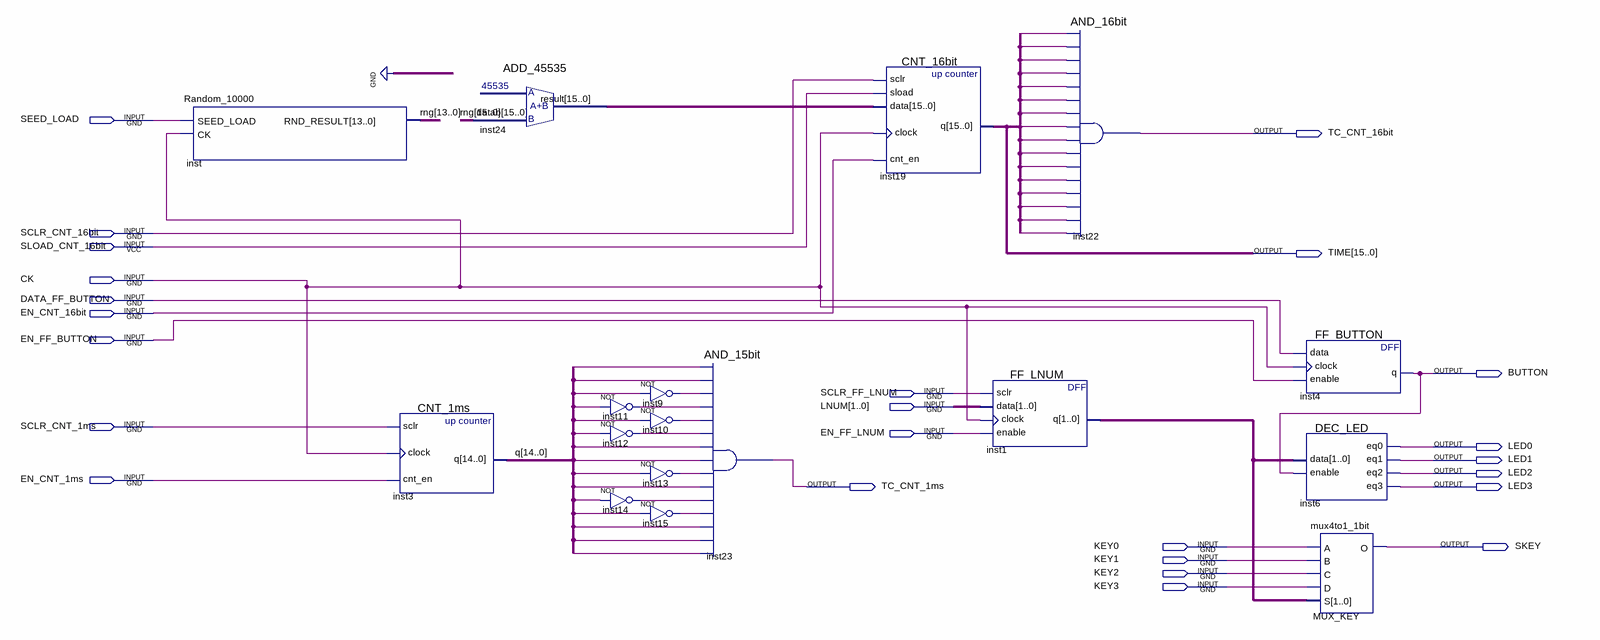
[diagram p0: schematic sheet]
// Quartus schematic reflexes_DP.bdf as structural Verilog: 17 symbols, 25 pins
module reflexes_DP (
  input  SEED_LOAD,
  input  SCLR_CNT_16bit,
  input  SLOAD_CNT_16bit,
  input  CK,
  input  DATA_FF_BUTTON,
  input  EN_CNT_16bit,
  input  EN_FF_BUTTON,
  input  SCLR_FF_LNUM,
  input  [1:0] LNUM,
  input  SCLR_CNT_1ms,
  input  EN_FF_LNUM,
  input  EN_CNT_1ms,
  input  KEY0,
  input  KEY1,
  input  KEY2,
  input  KEY3,
  output TC_CNT_16bit,
  output [15:0] TIME,
  output BUTTON,
  output LED0,
  output LED1,
  output LED2,
  output TC_CNT_1ms,
  output LED3,
  output SKEY
);

  wire inst9_out, inst10_out, inst11_out, inst12_out, inst13_out, inst14_out, inst15_out;
  wire [1:0] inst1_q;
  wire [13:0] rng;
  wire [14:0] q;
  wire [15:0] inst24_result;

  Random_10000 inst (.SEED_LOAD(SEED_LOAD), .CK(CK), .RND_RESULT(rng));
  CNT_1ms inst3 (.sclr(SCLR_CNT_1ms), .clock(CK), .cnt_en(EN_CNT_1ms), .q(q));
  ADD_45535 inst24 (.datab({2'b00, rng}), .result(inst24_result));
  not inst11 (inst11_out, q[11]);
  not inst12 (inst12_out, q[9]);
  not inst14 (inst14_out, q[4]);
  not inst9 (inst9_out, q[12]);
  not inst10 (inst10_out, q[10]);
  not inst13 (inst13_out, q[6]);
  not inst15 (inst15_out, q[3]);
  AND_15bit inst23 (
    .data0(q[14]), .data1(q[13]), .data2(inst9_out), .data3(inst11_out), .data4(inst10_out),
    .data5(inst12_out), .data6(q[8]), .data7(q[7]), .data8(inst13_out), .data9(q[5]), .data10(inst14_out),
    .data11(inst15_out), .data12(q[2]), .data13(q[1]), .data14(q[0]), .result(TC_CNT_1ms));
  CNT_16bit inst19 (
    .sclr(SCLR_CNT_16bit), .sload(SLOAD_CNT_16bit), .data(inst24_result), .clock(CK), .cnt_en(EN_CNT_16bit),
    .q(TIME));
  FF_LNUM inst1 (.sclr(SCLR_FF_LNUM), .data(LNUM), .clock(CK), .enable(EN_FF_LNUM), .q(inst1_q));
  AND_16bit inst22 (
    .data0(TIME[15]), .data1(TIME[14]), .data2(TIME[13]), .data3(TIME[12]), .data4(TIME[11]),
    .data5(TIME[10]), .data6(TIME[9]), .data7(TIME[8]), .data8(TIME[7]), .data9(TIME[6]), .data10(TIME[5]),
    .data11(TIME[4]), .data12(TIME[3]), .data13(TIME[2]), .data14(TIME[1]), .data15(TIME[0]),
    .result(TC_CNT_16bit));
  FF_BUTTON inst4 (.data(DATA_FF_BUTTON), .clock(CK), .enable(EN_FF_BUTTON), .q(BUTTON));
  DEC_LED inst6 (.data(inst1_q), .enable(BUTTON), .eq0(LED0), .eq1(LED1), .eq2(LED2), .eq3(LED3));
  mux4to1_1bit MUX_KEY (.A(KEY0), .B(KEY1), .C(KEY2), .D(KEY3), .S(inst1_q), .O(SKEY));

  // Other names for the same wires on the sheet: q1[15:0] = TIME
endmodule
